# EAGLE design RPi Lego Server Interconnect Board v1.0A (EAGLE 7.2.0)
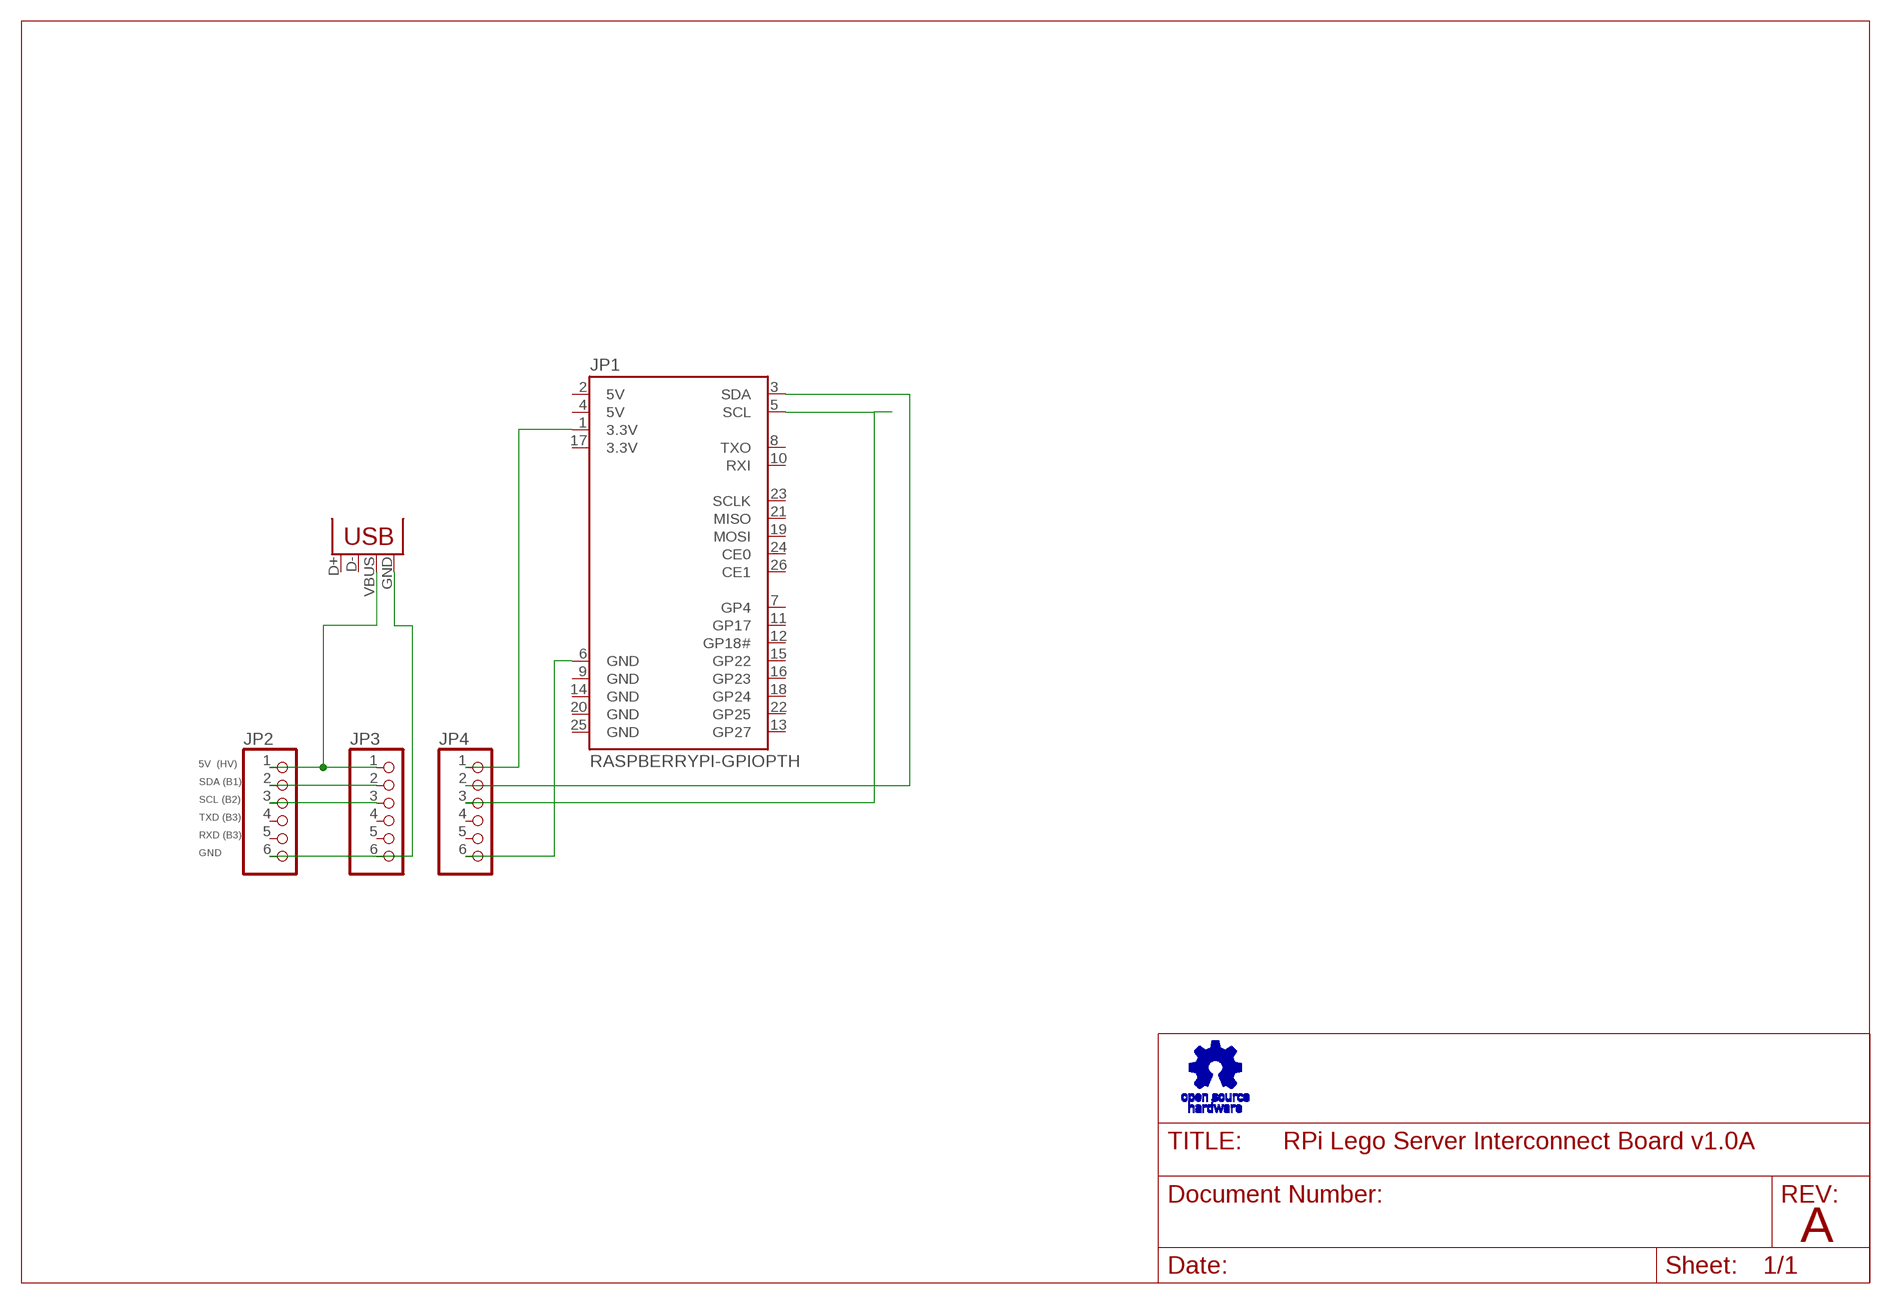
[diagram p0: schematic, sheet 1]

## Parts
JP1  RASPBERRYPI-GPIOPTH  [2X13-SHROUDED]
JP2  PINHD-1X6  [1X06]
JP3  PINHD-1X6  [1X06]
JP4  PINHD-1X6  [1X06]
JP5  USB-B  USBPTH  [USB-B-PTH]

## Nets
N$1: JP1.3(SDA) JP4.2
N$3: JP1.5(SCL) JP4.3
N$4: JP1.6(GND) JP4.6
N$5: JP2.6 JP3.6 JP5.GND
N$6: JP2.1 JP3.1 JP5.VBUS
N$7: JP2.2 JP3.2
N$8: JP2.3 JP3.3
N$9: JP1.1(3.3V) JP4.1
Unconnected: JP1.7(GP4) JP1.8(TXO) JP1.10(RXI) JP1.11(GP17) JP1.12(GP18#) JP1.13(GP27) JP1.15(GP22) JP1.16(GP23) JP1.18(GP24) JP1.19(MOSI) JP1.21(MISO) JP1.22(GP25) JP1.23(SCLK) JP1.24(CE0) JP1.26(CE1) JP2.4 JP2.5 JP3.4 JP3.5 JP4.4 JP4.5 JP5.D+ JP5.D-

## Notes on the sheet
- 5V  (HV)
- SDA (B1)
- SCL (B2)
- TXD (B3)
- RXD (B3)
- GND
- /Users/xjmaas/Downloads/OSHW_Logo.bmp
- A

## Power pins joined to a net without a drawn wire
3.3V: JP1.17(3.3V)
5V: JP1.2(5V) JP1.4(5V)
GND: JP1.9(GND) JP1.14(GND) JP1.20(GND) JP1.25(GND)

## Library data of the parts
JP1 = SparkFun-Boards:RASPBERRYPI-GPIO: RASPBERRY PI I/O HEADER As defined for the Revistion 2 Pi.; DIST: sparkfun; DIST_ID: PRT-11490
JP2-JP4 = pinhead:PINHD-1X6: PIN HEADER
JP5 = SparkFun-Connectors:USB: USB Connectors USB-B-PTH is fully proven SKU : PRT-00139/CONN-08278 USB-miniB is fully proven SKU : PRT-00587 USB-A-PCB is untested. USB-A-H is throughly reviewed, but untested. Spark Fun Electronics SKU : PRT-00437 USB-B-SMT is throughly reviewed, but untested. Needs silkscreen touching up. USB-A-S has not been used/tested USB-MB-H has not been used/tested USB-MICROB has been used. CONN-09505; PROD_ID: CONN-08278

## Net classes
0 default: drill 0.61 mm

## Board
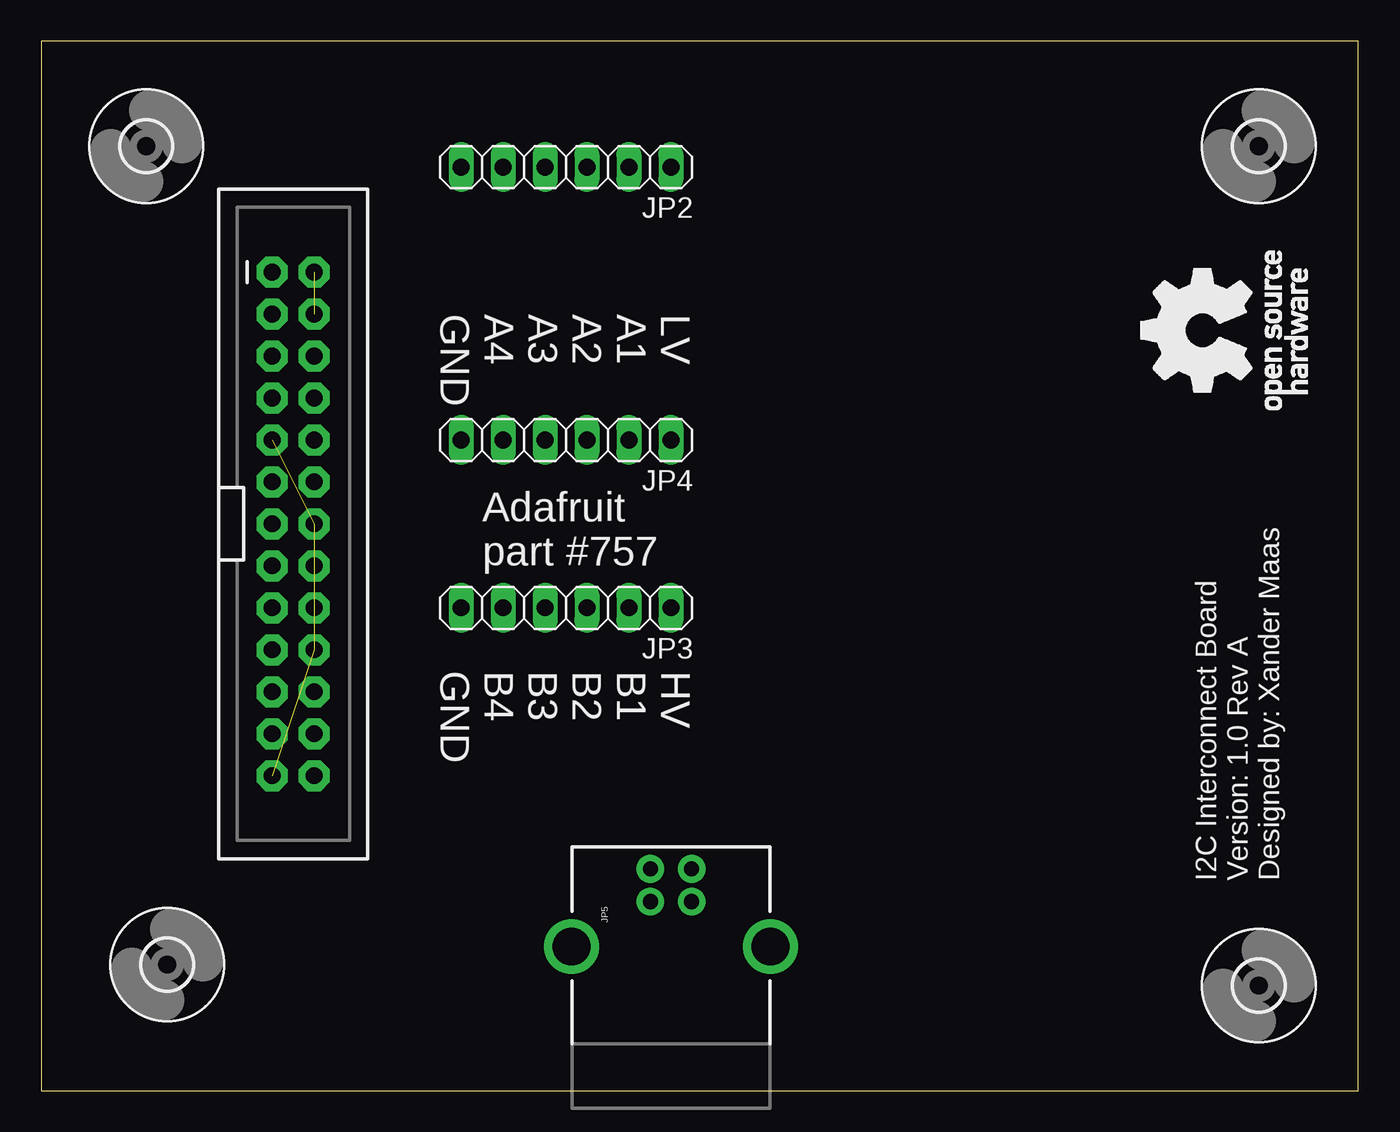
[diagram p1: board, top side]
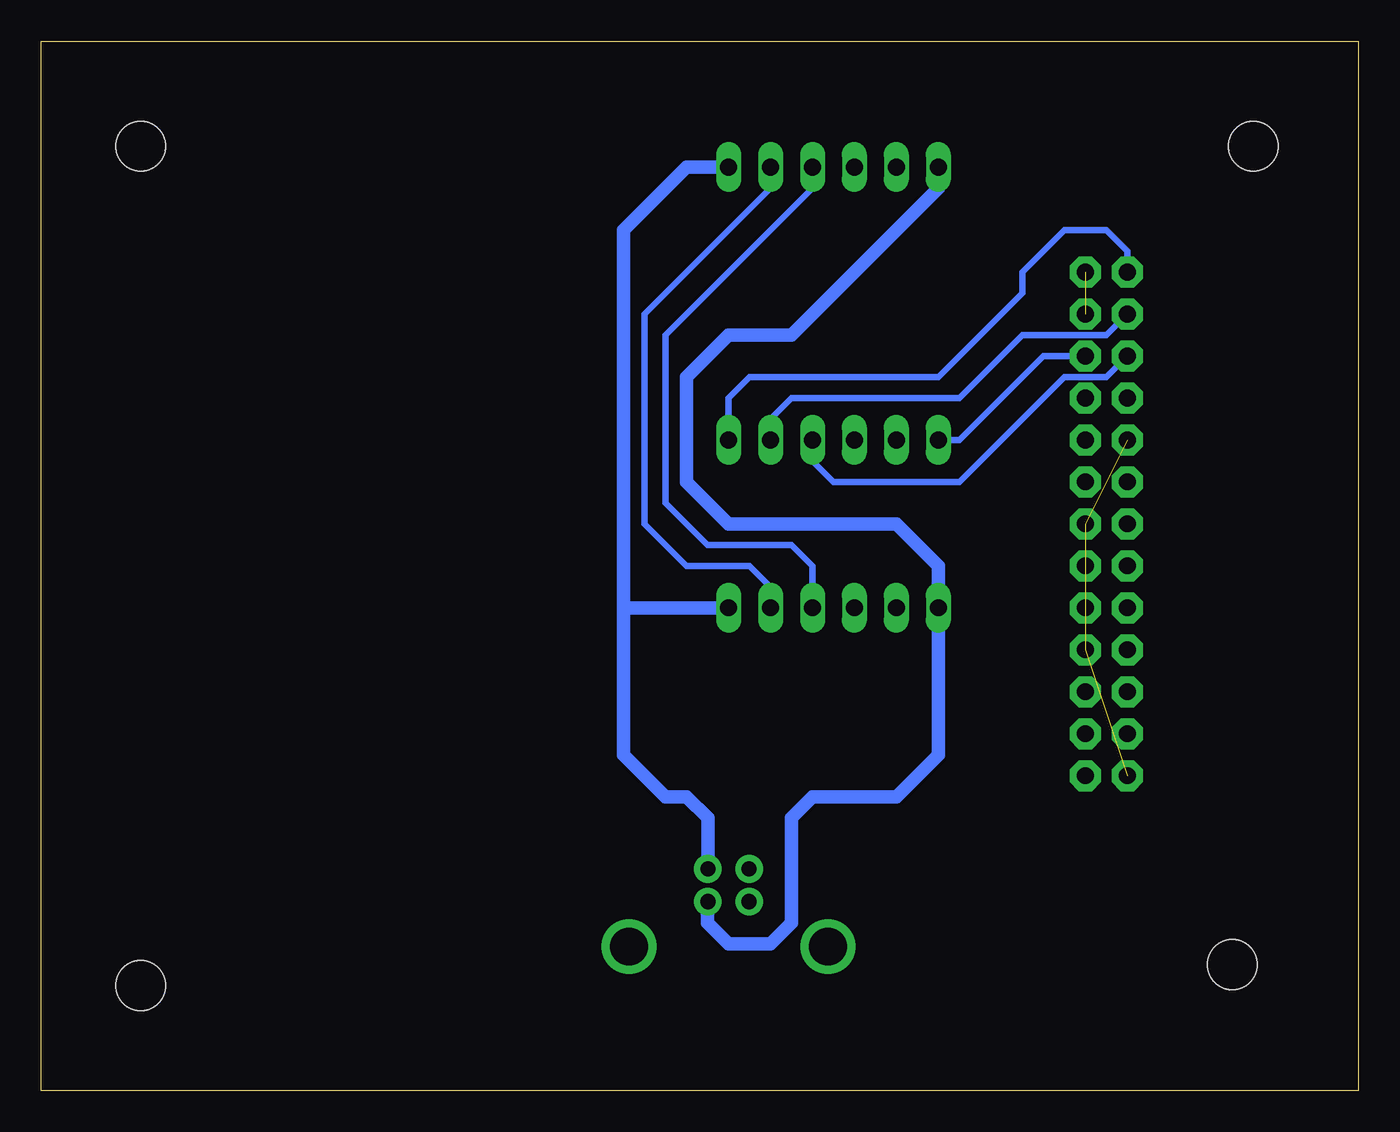
[diagram p2: board, bottom side, seen from below]

Size 79.68 x 63.49 mm. Coordinates in mm from the lower left corner, seen from the top.
Outline: 0,0 79.68,0 79.68,63.49 0,63.49 0,0
Copper layers (1*16): Top 0.035mm / dielectric 1.5mm / Bottom 0.035mm
Design rules "SeeedStudio_2layer_DRU_no_angle_20140221": minimum track width 6mil, minimum drill 12mil, track to track 6mil, track to pad 6mil, pad to pad 6mil, via to via 6mil, smd to smd 0mil, copper to edge 10mil, drill to drill 10mil, minimum pad ring 10mil, minimum via ring 6mil, stop-mask expansion 2mil, vias tented up to drill 100mil, thermal gap 10mil

### Footprints (pad centres in the part's own frame; a part is rotated, then mirrored left to right if it is on the bottom)
2X13-SHROUDED = drill 1.016 pad 1.88 octagon: 1 -1.27,15.24; 2 1.27,15.24; 3 -1.27,12.7; 4 1.27,12.7; 5 -1.27,10.16; 6 1.27,10.16; 7 -1.27,7.62; 8 1.27,7.62; 9 -1.27,5.08; 10 1.27,5.08; 11 -1.27,2.54; 12 1.27,2.54; 13 -1.27,0; 14 1.27,0; 15 -1.27,-2.54; 16 1.27,-2.54; 17 -1.27,-5.08; 18 1.27,-5.08; 19 -1.27,-7.62; 20 1.27,-7.62; 21 -1.27,-10.16; 22 1.27,-10.16; 23 -1.27,-12.7; 24 1.27,-12.7; 25 -1.27,-15.24; 26 1.27,-15.24
1X06 = drill 1.016 long: 1 -6.35,0; 2 -3.81,0; 3 -1.27,0; 4 1.27,0; 5 3.81,0; 6 6.35,0
USB-B-PTH = drill 0.914 pad 1.676: D+ 0,1.25; D- 1.981,1.25; GND 0,-1.25; VBUS 1.981,-1.25 | drill 2.286: S1 -2.718,-6.02; S2 -2.718,6.02
3,0 = hole 3: 0,0

### Placement (x,y rotation side)
JP1  15.24,34.29 0 top
JP2  31.75,55.88 180 top
JP3  31.75,29.21 180 top
JP4  31.75,39.37 180 top
JP5  38.1,11.43 90 top
U$2  [3,0]  73.66,6.35 0 top
U$3  [3,0]  73.66,57.15 0 top
U$4  [3,0]  6.35,57.15 0 top
U$5  [3,0]  7.62,7.62 0 top

### Tracks (layer width: path | path; a pad name or v marks a point on that pad's centre or on a via)
5V  (1 unrouted)
GND  (3 unrouted)
N$1
  Bottom 0.406: JP1.3 15.24,45.72 20.32,45.72 24.13,41.91 34.29,41.91 35.56,40.64 JP4.2
N$3
  Bottom 0.406: JP1.5 15.24,43.18 17.78,43.18 24.13,36.83 31.75,36.83 33.02,38.1 JP4.3
N$4
  Bottom 0.406: JP1.6 19.05,44.45 24.13,39.37 JP4.6
N$5
  Bottom 0.406: 39.37,11.41 JP5.GND
  Bottom 0.813: 39.37,11.41 39.37,10.16 38.1,8.89 35.56,8.89 34.29,10.16 34.29,16.51 33.02,17.78 27.94,17.78 25.4,20.32 JP3.6 25.4,31.75 27.94,34.29 38.1,34.29 40.64,36.83 40.64,43.18 38.1,45.72 34.29,45.72 25.4,54.61 JP2.6
N$6
  Bottom 0.813: JP5.VBUS 39.35,16.49 40.64,17.76 41.91,17.78 44.45,20.32 44.45,29.21 | 44.45,29.21 JP3.1 | JP2.1 40.64,55.88 44.45,52.07 44.45,29.21
N$7
  Bottom 0.406: JP2.2 35.56,54.61 43.18,46.99 43.18,34.29 40.64,31.75 36.83,31.75 35.56,30.48 JP3.2
N$8
  Bottom 0.406: JP3.3 33.02,31.75 34.29,33.02 39.37,33.02 41.91,35.56 41.91,45.72 33.02,54.61 JP2.3
N$9
  Bottom 0.406: JP4.1 38.1,41.91 36.83,43.18 25.4,43.18 20.32,48.26 20.32,49.53 17.78,52.07 15.24,52.07 13.97,50.8 JP1.1

### Text on the board
tPlace: /Users/xjmaas/Downloads/OSHW_Logo.bmp | I2C Interconnect Board / Version: 1.0 Rev A / Designed by: Xander Maas
tNames: LV / A1 / A2 / A3 / A4 / GND | Adafruit / part #757 | HV / B1 / B2 / B3 / B4 / GND